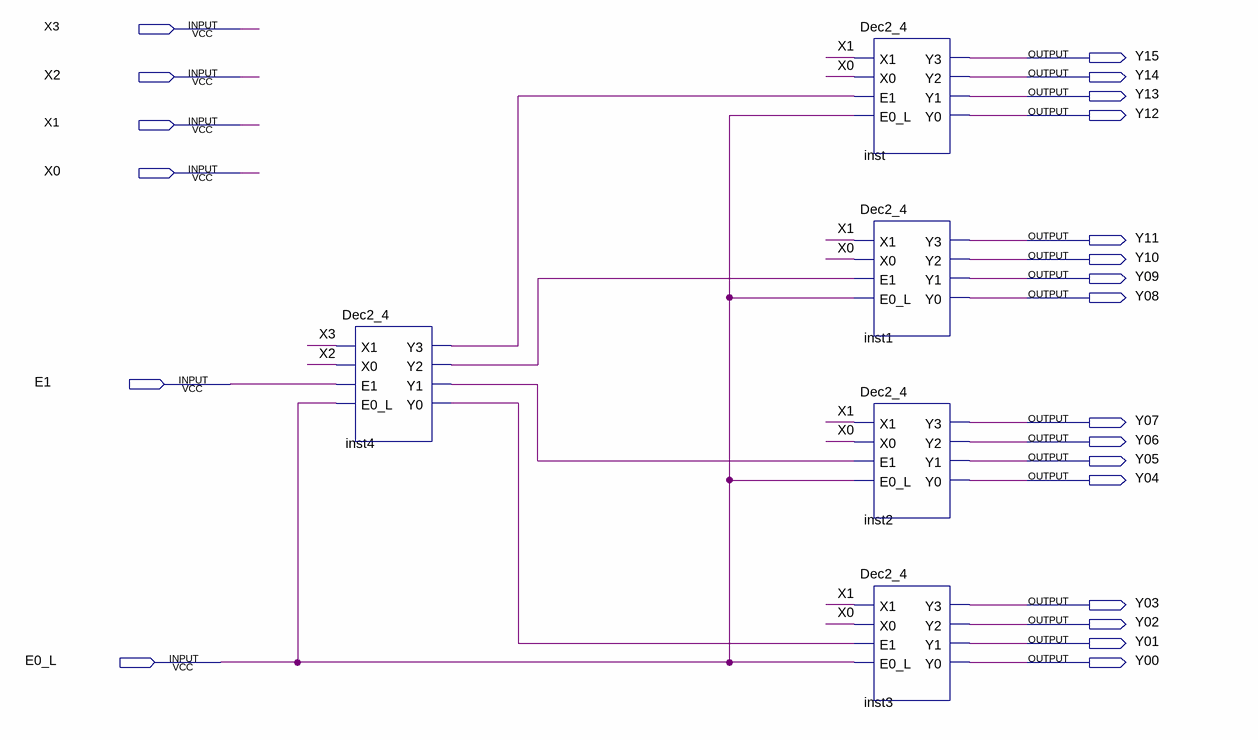
[diagram p0: schematic sheet]
// Quartus schematic Dec4_16.bdf as structural Verilog: 5 symbols, 22 pins
module Dec4_16 (
  input  X3,
  input  X2,
  input  X1,
  input  X0,
  input  E1,
  input  E0_L,
  output Y15,
  output Y14,
  output Y13,
  output Y12,
  output Y11,
  output Y10,
  output Y09,
  output Y08,
  output Y07,
  output Y06,
  output Y05,
  output Y04,
  output Y03,
  output Y02,
  output Y01,
  output Y00
);

  wire inst4_y0, inst4_y1, inst4_y2, inst4_y3;

  Dec2_4 inst4 (.X1(X3), .X0(X2), .E1(E1), .E0_L(E0_L), .Y3(inst4_y3), .Y2(inst4_y2), .Y1(inst4_y1), .Y0(inst4_y0));
  Dec2_4 inst (.X1(X1), .X0(X0), .E1(inst4_y3), .E0_L(E0_L), .Y3(Y15), .Y2(Y14), .Y1(Y13), .Y0(Y12));
  Dec2_4 inst1 (.X1(X1), .X0(X0), .E1(inst4_y2), .E0_L(E0_L), .Y3(Y11), .Y2(Y10), .Y1(Y09), .Y0(Y08));
  Dec2_4 inst2 (.X1(X1), .X0(X0), .E1(inst4_y1), .E0_L(E0_L), .Y3(Y07), .Y2(Y06), .Y1(Y05), .Y0(Y04));
  Dec2_4 inst3 (.X1(X1), .X0(X0), .E1(inst4_y0), .E0_L(E0_L), .Y3(Y03), .Y2(Y02), .Y1(Y01), .Y0(Y00));
endmodule
